# EAGLE schematic single_trigger_in_board (EAGLE 9.5.1)
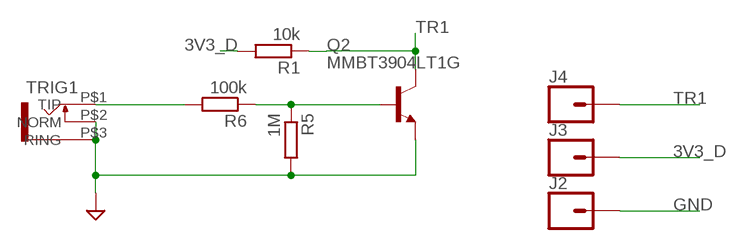
[diagram p0: schematic, sheet 1]

## Parts
J2  CONN_01  [1X01]
J3  CONN_01  [1X01]
J4  CONN_01  [1X01]
Q2  MMBT3904LT1G  TRANSISTOR_MMBT3904LT1-NPN-SOT23-BEC  [TRANSISTOR_SOT23-BEC]
R1  10k  R-EU_R0603  [R0603]
R5  1M  R-EU_R0603  [R0603]
R6  100k  R-EU_R0603  [R0603]
TRIG1  JACK_KOBICONN_PJM301DM_V2  [KOBICONN_PJM301DM_JACK]

## Nets
3V3_D: J3.1 R1.2
GND: J2.1 Q2.E R5.2 TRIG1.P$2(NORM) TRIG1.P$3(RING)
N$18: R6.2 TRIG1.P$1(TIP)
N$19: Q2.B R5.1 R6.1
TR1: J4.1 Q2.C R1.1

## Library data of the parts
J2-J4 = SparkFun-Connectors:CONN_01: Single connection point. Often used as Generic Header-pin footprint for 0.1 inch spaced/style header connections On any of the 0.1 inch spaced packages, you can populate with these: Break Away Headers - Straight <https://www.sparkfun.com/products/116> (PRT-00116) Break Away Male Headers - Right Angle <https://www.sparkfun.com/products/553> (PRT-00553) Female Headers <https://www.sparkfun.com/products/115> (PRT-00115) Break Away Headers - Machine Pin <https://www.sparkfun.com/products/117> (PRT-00117) Break Away Female Headers - Swiss Machine Pin <https://www.sparkfun.com/products/743> (PRT-00743) This device is also useful as a general connection point to wire up your design to another part of your project. Our various solder wires solder well into these plated through hole pads. Hook-Up Wire - Assortment (Stranded, 22 AWG) <https://www.sparkfun.com/products/11375> (PRT-11375) Hook-Up Wire - Assortment (Solid Core, 22 AWG) <https://www.sparkfun.com/products/11367> (PRT-11367) View the entire wire category on our website here <https://www.sparkfun.com/categories/141> Special notes: SMTSO-256-ET is a "flush mount" nut for a 4-40 screw. We mostly use this on specialty testbeds; it is a nice way to connect hardware to your PCB at an adjustable hieght. Also note, the SNAP packages are for using a snappable style connector. We sell a baggie of snaps and they are also used on two LilyPad designs: Snap Assortment - 30 pack (male and female) <https://www.sparkfun.com/products/11347> (DEV-11347) LilyPad Arduino SimpleSnap <https://www.sparkfun.com/products/10941> (DEV-10941) LilyPad SimpleSnap Protoboard <https://www.sparkfun.com/products/10940> (DEV-10940)
Q2 = braids_v50:TRANSISTOR_*-NPN-: NPN Transistror BF959 corrected 2008.03.06
R1 R5 R6 = rcl:R-EU_: RESISTOR, European symbol; SPICEPREFIX: R
TRIG1 = 0000-master:JACK_KOBICONN_PJM301DM_V2